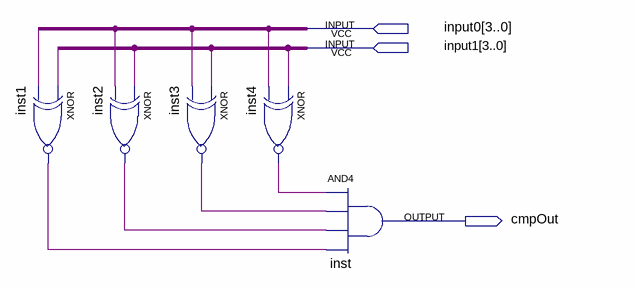
[diagram p0: schematic sheet]
// Quartus schematic EqCmp4.bdf as structural Verilog: 5 symbols, 3 pins
module EqCmp4 (
  input  [3:0] input0,
  input  [3:0] input1,
  output cmpOut
);

  wire inst1_out, inst2_out, inst3_out, inst4_out, undriven, undriven_2, undriven_3, undriven_4, undriven_5,
       undriven_6, undriven_7, undriven_8;

  xnor inst1 (inst1_out, undriven_5, undriven);
  xnor inst2 (inst2_out, undriven_6, undriven_2);
  xnor inst3 (inst3_out, undriven_7, undriven_3);
  xnor inst4 (inst4_out, undriven_8, undriven_4);
  and inst (cmpOut, inst4_out, inst3_out, inst2_out, inst1_out);
endmodule
